# EasyEDA Pro project ProPrj_NavBot-EN01_2025-11-07.epro, board CODER
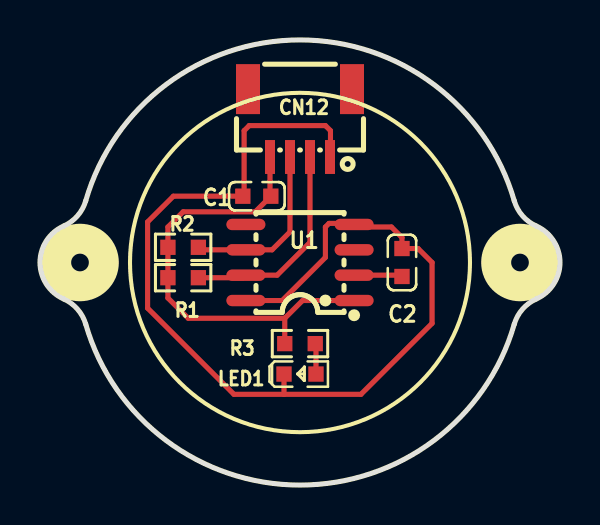
[diagram p8: board, top side]
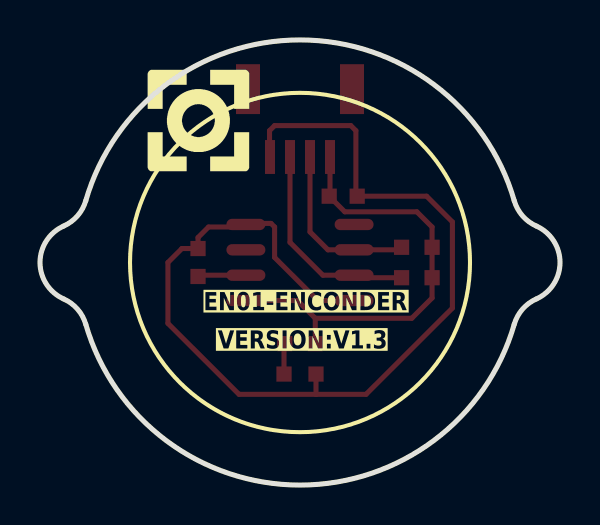
[diagram p9: board, bottom side, seen from below]

Outline 26 x 22.3 mm; copper layers: Top Layer, Bottom Layer. Coordinates in mm from the lower left corner of the outline.
Outline path: 1.18,9.32 arc(0,11.15) 1.18,12.98 arc(1.88,13.49) 2.29,14.25 arc(13,22.3) 23.71,14.25 arc(24.12,13.49) 24.82,12.98 arc(26,11.15) 24.82,9.32 arc(24.12,8.81) 23.71,8.05 arc(13,0) 2.29,8.05 arc(1.88,8.81) 1.18,9.32
Stack: Top Layer 0.035mm / Dielectric1 1.51mm FR4 er 4.5 / Bottom Layer 0.035mm

## Design rules (mm)
spacing Default (default): track to track 0.152, other pairs 0 to 0.152
track width Default (default): min 0.254, default 0.254, max 25.4
differential pair differentialPair (default): width min 0.127, default 0.254, max 2.54; gap min 0.152, default 0.152
via Default (default): diameter min 0.61, default 0.61, max 100.025; hole min 0.305, default 0.305, max 59.995

## Placement (name value [footprint] x y rotation side)
C1  100nf  [C0603]  10.84 14.45 0 top
C2  1uf  [C0603]  18.08 11.15 270 top
CN12  WAFER-SH1.0-4PWB  [CONN-SMD_4P-P1.00_WAFER-SH1.0-4PWB]  13 18.13 180 top
LED1  KT-0603R  [LED0603-RD]  13 5.56 0 top
R1  5.1kΩ  [R0603]  7.16 10.39 180 top
R2  5.1kΩ  [R0603]  7.16 11.91 180 top
R3  5.1kΩ  [R0603]  13 7.09 180 top
U1  AS5600-ASOM  [SOIC-8_L5.0-W4.0-P1.27-LS6.0-BL]  13 11.15 90 top

## Footprints (pads in the part's own frame, mm; a bottom-side part is the same pattern mirrored in y, then rotated)
C0603
  rect 0.762x0.762 smd: 1(-0.7,0.019) 2(0.7,0.019)
CONN-SMD_4P-P1.00_WAFER-SH1.0-4PWB
  rect 0.5x1.7 smd: 1(-1.5,1.7) 2(-0.5,1.7) 3(0.5,1.7) 4(1.5,1.7)
  rect 1.2x2.5 smd: 5(-2.6,-1.7) 6(2.6,-1.7)
LED0603-RD
  rect 0.762x0.762 smd: 1(-0.799,0) 2(0.799,0)
R0603
  rect 0.762x0.762 smd: 1(-0.762,0) 2(0.762,0)
SOIC-8_L5.0-W4.0-P1.27-LS6.0-BL
  oval 0.569x1.95 smd: 1(-1.905,-2.705) 2(-0.635,-2.705) 3(0.635,-2.705) 4(1.905,-2.705) 5(1.905,2.705) 6(0.635,2.705) 7(-0.635,2.705) 8(-1.905,2.705)

## Nets
As in the schematic.

Pads without a net: CN12 5 6; U1 3 5

## Routing (per net, layer and track width the routed paths; a pad name or vN(x,y) marks a point on that pad's centre or on a via; arc(x,y) is an arc through that point)
GND: length 53.3
  Top Layer w0.254: CN12.1 14.52,16.46 14.52,17.75 14.27,18.01 10.46,18.01 10.21,17.75 10.21,14.54 10.14,14.47 6.67,14.47 5.38,13.18 5.38,8.86 9.7,4.55 12.2,4.55 ; U1.8 12.11,9.24 14.27,11.4 14.27,12.93 14.45,13.11 15.65,13.11 U1.4 15.83,12.93 17.57,12.93 18.1,12.4 C2.1 18.9,11.85 19.6,11.15 19.6,8.1 16.05,4.55 12.2,4.55 ; LED1.1 12.2,4.55
VCC: length 22.7
  Top Layer w0.254: 12.24,8.36 13.13,9.24 U1.1 ; 12.24,8.36 7.41,8.36 6.4,9.37 R1.2 R2.2 6.4,12.93 7.16,13.69 10.76,13.69 11.54,14.47 11.5,14.51 CN12.4 ; 12.24,8.36 R3.2
VCC3.3: length 2.4
  Top Layer w0.254: U1.2 18.03,10.51 C2.2
SCL: length 10.6
  Top Layer w0.254: CN12.2 13.5,12.16 11.86,10.51 U1.7 10.17,10.39 R1.1
SDA: length 8.8
  Top Layer w0.254: CN12.3 12.5,12.68 11.6,11.78 U1.6 8.05,11.78 R2.1
$1N1404: length 1.5
  Top Layer w0.254: LED1.2 13.8,7.05 R3.1

## Text on the board
Bottom Silkscreen Layer: VERSION:V1.3 | EN01-ENCONDER
